# Altium schematic sheet MD_Power.SchDoc
size A3; SheetNumber: 2; SheetTotal: 2
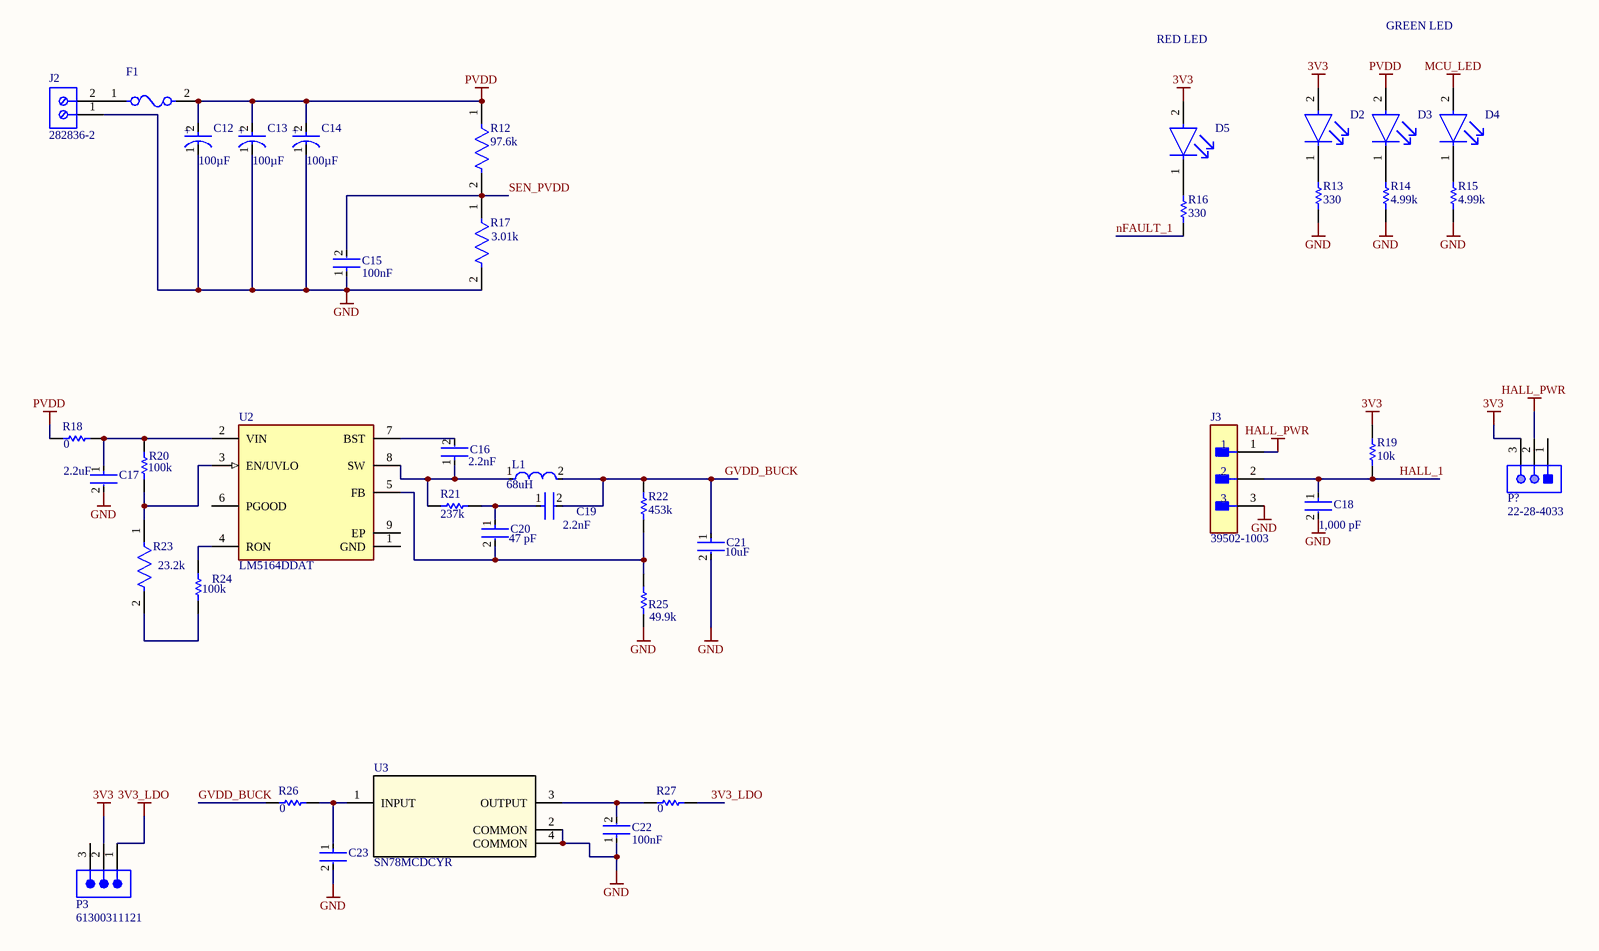
[diagram p0: MD_Power.SchDoc]

## Parts
C12  Capacitance: 100µF  [FP-TG-J16-MFG]  (hidden comment: EEV-TG2A101M)
C13  Capacitance: 100µF  [FP-TG-J16-MFG]  (hidden comment: EEV-TG2A101M)
C14  Capacitance: 100µF  [FP-TG-J16-MFG]  (hidden comment: EEV-TG2A101M)
C15  Capacitance: 100nF  [FP-1206-L_3_2_0_2-W_1_6_0-MFG]  (hidden comment: 12061C104KAZ2A)
C16  Capacitance: 2.2nF  [FP-1206-L_3_2_0_2-W_1_6_0-IPC_B]  (hidden comment: 12061A222JAT2A)
C17  Capacitance: 2.2uF  [FP-C3216-160-0_2-IPC_B]  (hidden comment: C3216X7S2A225K160AB)
C18  Capacitance: 1,000 pF  [FP-C1206C-EB-MFG]  (hidden comment: C1206C102J1GACTU)
C19  Capacitance: 2.2nF  [FP-1206-L_3_2_0_2-W_1_6_0-IPC_B]  (hidden comment: 12061A222JAT2A)
C20  Capacitance: 47 pF  [FP-C1206C-EB-MFG]  (hidden comment: C1206C470J1GACTU)
C21  Capacitance: 10uF  [FP-GRM31C-0_2-e0_3_0_8-MFG]  (hidden comment: GRM31CR71E106KA12L)
C22  Capacitance: 100nF  [FP-1206-L_3_2_0_2-W_1_6_0-MFG]  (hidden comment: 12061C104KAZ2A)
C23  C1206C334K5RACTU  [FP-C1206C-EB-MFG]  (value not drawn)
D2  LTST-C171GKT  [FP-LTST-C171GKT-MFG]  (value not drawn)
D3  LTST-C171GKT  [FP-LTST-C171GKT-MFG]  (value not drawn)
D4  LTST-C171GKT  [FP-LTST-C171GKT-MFG]  (value not drawn)
D5  HSMS-C150  [FP-HSMS-C150-MFG]  (value not drawn)
F1  0456030.ER  [FP-0456-MFG]  (value not drawn)
J2  282836-2  [TECO-282836-2_V]
J3  39502-1003  [FP-39502-1003-MFG]
L1  Inductance: 68uH  [FP-CDRH125-MFG]  (hidden comment: CDRH125NP-680MC)
P3  61300311121  [61300311121]
P?  22-28-4033  [MOLX-22-28-4033_V]
R12  Resistance: 97.6k  [FP-CR1206-MFG]  (hidden comment: CR1206-FX-9762ELF)
R13  Resistance: 330  [RESC3216X70X50NL05T20]  (hidden comment: ERJ-8GEYJ331V)
R14  Resistance: 4.99k  [RESC3216X60X45ML10T20]  (hidden comment: CRCW12064K99FKEA)
R15  Resistance: 4.99k  [RESC3216X60X45ML10T20]  (hidden comment: CRCW12064K99FKEA)
R16  Resistance: 330  [RESC3216X70X50NL05T20]  (hidden comment: ERJ-8GEYJ331V)
R17  Resistance: 3.01k  [FP-CRCW1206-e3-MFG]  (hidden comment: CRCW12063K01FKEA)
R18  Resistance: 0  [RESC3216X70X50NL05T20]  (hidden comment: ERJ-8GEY0R00V_DNP)
R19  Resistance: 10k  [RESC3116X65X50NL20T20]  (hidden comment: CRCW120610K0FKEAHP)
R20  Resistance: 100k  [RESC3216X70X50LL05T20]  (hidden comment: ERJ-8GEYJ104V)
R21  Resistance: 237k  [RESC3216X70X50LL05T20]  (hidden comment: ERJ-8ENF2373V)
R22  Resistance: 453k  [RESC3216X70X50NL05T20]  (hidden comment: ERJ-8ENF4533V)
R23  Resistance: 23.2k  [FP-CR1206-MFG]  (hidden comment: CR1206-FX-2322ELF)
R24  Resistance: 100k  [RESC3216X70X50LL05T20]  (hidden comment: ERJ-8GEYJ104V)
R25  Resistance: 49.9k  [RESC3216X65X50ML15T25]  (hidden comment: TNPW120649K9BEEA)
R26  Resistance: 0  [RESC3216X70X50NL05T20]  (hidden comment: ERJ-8GEY0R00V_DNP)
R27  Resistance: 0  [RESC3216X70X50NL05T20]  (hidden comment: ERJ-8GEY0R00V)
U2  LM5164DDAT  [FP-DDA0008E-MFG]
U3  SN78MCDCYR  [DCY0004A_N]

## Nets
3V3: D2.2(A) D5.2(A) P3.2 P?.3 R19.2
3V3_LDO: P3.1 R27.2
GND: C12.1(C) C13.1(C) C14.1(C) C15.1 C17.2 C18.2 C21.2 C22.1 C23.2 J2.1 J3.3 R13.1 R14.1 R15.1 R17.2 R25.1 U3.2(COMMON) U3.4(COMMON)
HALL_PWR: J3.1 P?.2
MCU_LED: D4.2(A)
PVDD: C12.2(A) C13.2(A) C14.2(A) D3.2(A) F1.2 R12.1 R18.1
GVDD_BUCK: C19.2 C21.1 L1.2 R22.2 R26.1
HALL_1: C18.1 J3.2 R19.1
nFAULT_1: R16.1
SEN_PVDD: C15.2 R12.2 R17.1
NetC16_1: C16.1 L1.1 R21.1 U2.8(SW)
NetC16_2: C16.2 U2.7(BST)
NetC17_1: C17.1 R18.2 R20.2 U2.2(VIN)
NetC19_1: C19.1 C20.1 R21.2
NetC20_2: C20.2 R22.1 R25.2 U2.5(FB)
NetC22_2: C22.2 R27.1 U3.3(OUTPUT)
NetC23_1: C23.1 R26.2 U3.1(INPUT)
NetD2_1: D2.1(C) R13.2
NetD3_1: D3.1(C) R14.2
NetD4_1: D4.1(C) R15.2
NetD5_1: D5.1(C) R16.2
NetF1_1: F1.1 J2.2
NetR20_1: R20.1 R23.1 U2.3(EN/UVLO)
NetR23_2: R23.2 R24.1
NetR24_2: R24.2 U2.4(RON)

Not connected (* = marked no-connect by the designer): P3 3; P? 1; U2 1(GND) 6(PGOOD) 9(EP)

## Notes on the sheet
- RED LED
- GREEN LED
- (in symbol CMP-00287-39480900-1) +

## Library data of the parts
C12-C14 = CMP-00287-39480900-1: Aluminum Electrolytic Capacitor, 100 uF, 100 V, ± 20%, 2000 hours @ 125°C, Radial Can - SMD; Ripple Current (AC): 350mA; Voltage Rating: 100V; Dissipation Factor: 10%; ESR (Equivalent Series Resistance): 300mΩ; Polarity: Polar; Leakage Current: 100µA; Lifecycle Status: Production; Height: 16.5mm; Lead Free: Lead Free; Case/Package: Radial; Termination: SMD/SMT; Tolerance: 20%; REACH SVHC: No SVHC; Schedule B: 8532220020, 8532220020; Ripple Current: 350mA; Mount: PCB, Surface Mount; Length: 16.5mm; Life (Hours): 2000hours; Radiation Hardening: No; Width: 1.2mm; Min Operating Temperature: -40°C; RoHS: Compliant; Voltage Rating (DC): 100V; Packaging: Cut Tape; Max Operating Temperature: 125°C; Diameter: 16mm; Height - Seated (Max): 16.51mm
C15 C22 = CMP-04427-004798-1: General Purpose Ceramic Capacitor, 1206, 100nF, 10%, X7R, 15%, 100V; Features: Soft Termination; Termination: SMD/SMT; Mount: Surface Mount; Tolerance: 10%; Voltage Rating: 100V; Length: 3.2mm; Case/Package: 1206; Case Code (Metric): 3216; RoHS Compliant: Yes; Package Quantity: 1; Max Operating Temperature: 125°C; Voltage Rating (DC): 100V; Min Operating Temperature: -55°C; Number of Pins: 2; Packaging: Tape and Reel; Width: 0.063inch; REACH SVHC: No SVHC; Lead Free: Lead Free; Construction: Flat; Radiation Hardening: No; Case Code (Imperial): 1206; Thickness: 0.05inch; Series: FLEXITERM®; Depth: 1.6mm; Dielectric: X7R
C16 C19 = CMP-04427-004655-1: General Purpose Ceramic Capacitor, 1206, 2.2nF, 5%, NP0, 30ppm/°C, 100V; Dielectric: C0G; Width: 0.063inch; Packaging: Tape and Reel; Depth: 1.6mm; Lead Free: Lead Free; Min Operating Temperature: -55°C; Radiation Hardening: No; Max Operating Temperature: 125°C; Thickness: 0.06inch; Temperature Coefficient: 30ppm/°C; Termination: SMD/SMT; Contact Plating: Tin; Voltage Rating: 100V; Number of Pins: 2; Case Code (Metric): 3216; Voltage Rating (DC): 100V; REACH SVHC: No SVHC; Voltage: 100V; RoHS Compliant: Yes; Package Quantity: 1; Height: 0.5mm; Case/Package: 1206; Length: 3.2mm; Mount: Surface Mount; Tolerance: 5%; Case Code (Imperial): 1206
C17 = CMP-08246-004303-1: Multilayer Ceramic Capacitors 2.2uF ±10% 100V X7S SMD 1206; Min Operating Temperature: -55°C; Tolerance: 10%; Number of Pins: 2; Case Code (Metric): 3216; REACH SVHC: No SVHC; Package Quantity: 1; Lead Free: Lead Free; Termination: SMD/SMT; Voltage Rating (DC): 100V; Voltage Rating: 100V; Case Code (Imperial): 1206; Dielectric: X7S; Height: 1.6mm; Packaging: Tape and Reel; Weight: 0.000571oz; Radiation Hardening: No; Mount: Surface Mount; Width: 0.063inch; Length: 3.2mm; Case/Package: 1206; Depth: 1.6mm; RoHS Compliant: Yes; Max Operating Temperature: 125°C; Series: C; Voltage: 100V; Resistor Type: Ceramic; Thickness: 0.071inch; Construction: Flat
C18 = CMP-03020-000955-1: Multilayer Ceramic Capacitor, C Series, 1000 Pf, - 5%, C0g / Np0, 100 V, 1206 [3216 Metric] Rohs Compliant: Yes; Manufacturer: KEMET; Voltage Rating: 100 V; Tolerance: 0.05; Automotive Grade: Grade 0; Temperature Coefficient: 15%; Value: 1,000 pF; Material: Ceramic; Ipc Land Pattern Name: CAPC320160X78; Octopart: https://octopart.com/c1206c102j1gactu-kemet-99808; Height: 0.88mm; Device Class L3: Ceramic Capacitors; Manufacturer Part Number: C1206C102J1GACTU; Digikey Description: Multilayer Ceramic Capacitor, C Series, 1000 Pf, - 5%, C0g / Np0, 100 V, 1206 [3216 Metric] Rohs Compliant: Yes; Package: C1206C-EB; Temperature: -55°C to +150°C; Category: Cap; Temperature Range High: +150°C; ComponentLink2Description: Datasheet; RoHS: TRUE; Temperature Range Low: -55°C; Device Class L1: Passive Components; Device Class L2: Capacitors; Lead Free: Yes; Automotive: Yes; ComponentLink2URL: https://content.kemet.com/datasheets/KEM_C1007_X8R_ULTRA_150C_SMD.pdf; Mouser Description: Multilayer Ceramic Capacitors MLCC - SMD/SMT 100volts 1000pF C0G 5%; Temperature Characteristic: C0G
C20 = CMP-1037-01300-2: CAP CER 47PF 100V 5% NP0 1206; Manufacturer: KEMET; Tolerance: 0.05; Material: Ceramic; Temperature Coefficient: 15%; Temperature Characteristic: C0G; Automotive Grade: Grade 0; Digikey Description: CAP CER 47PF 100V 5% NP0 1206; Temperature: -55°C to +150°C; Temperature Range Low: -55°C; Height: 0.88mm; RoHS: TRUE; Value: 47 pF; ComponentLink2URL: https://content.kemet.com/datasheets/KEM_C1007_X8R_ULTRA_150C_SMD.pdf; Octopart: https://octopart.com/c1206c470j1gactu-kemet-3801704; Temperature Range High: +150°C; Category: Cap; Mouser Description: 1206 47pF Ceramic Multilayer Capacitor; 100VDC; 125degC; C0G Dielec; +/-5% SMD; Package: C1206C-EB; Manufacturer Part Number: C1206C470J1GACTU; Ipc Land Pattern Name: CAPC320160X78; ComponentLink2Description: Datasheet; Device Class L1: Passive Components; Device Class L2: Capacitors; Voltage Rating: 100 V; Lead Free: Yes; Automotive: Yes; Device Class L3: Ceramic Capacitors
C21 = CMP-06035-003589-1: Chip Multilayer Ceramic Capacitors for General Purpose, 1206, 10uF, X7R, 15%, 10%, 25V; Case Code (Imperial): 1206; Voltage Rating (DC): 25V; Voltage Rating: 25V; Length: 3.2mm; Lead Free: Lead Free; Thickness: 0.071inch; Package Quantity: 1; Width: 1.6mm; Max Operating Temperature: 125°C; Number of Pins: 2; Height: 1.6mm; Case Code (Metric): 3216; REACH SVHC: No SVHC; Radiation Hardening: No; Case/Package: 1206; Material: Ceramic; Tolerance: 10%; Voltage: 25V; Mount: Surface Mount; Packaging: Tape and Reel; Dielectric: X7R; Termination: SMD/SMT; Min Operating Temperature: -55°C; Depth: 1.6mm
C23 = CMP-1037-04487-2: CAP CER 0.33UF 50V X7R 1206; Manufacturer: KEMET; Tolerance: 0.1; Automotive Grade: Grade 0; Value: 0.33 μF; Material: Ceramic; Temperature Coefficient: 15%; Ipc Land Pattern Name: CAPC320160X78; Octopart: https://octopart.com/c1206c334k5ractu-kemet-146059; Height: 0.88mm; Package: C1206C-EB; Manufacturer Part Number: C1206C334K5RACTU; ComponentLink2Description: Datasheet; Digikey Description: CAP CER 0.33UF 50V X7R 1206; Voltage Rating: 50 V; Temperature Range High: +150°C; Temperature: -55°C to +150°C; Automotive: Yes; Lead Free: Yes; Mouser Description: Multilayer Ceramic Capacitors MLCC - SMD/SMT 50volts 0.33uF X7R 10%; Category: Cap; RoHS: TRUE; Temperature Characteristic: X7R; Capacitance: 0.33 μF; Device Class L1: Passive Components; Temperature Range Low: -55°C; Device Class L2: Capacitors; Device Class L3: Ceramic Capacitors; ComponentLink2URL: https://content.kemet.com/datasheets/KEM_C1007_X8R_ULTRA_150C_SMD.pdf
D2-D4 = CMP-22017-000007-1: LED GREEN CLEAR CHIP SMD; Luminous Intensity: 12mcd; Lens Color: Colorless; Dominant Wavelength: 569nm; Number of LEDs: 1; Power Dissipation: 100mW; Viewing Angle: 130°; Reverse Voltage: 5V; Test Current: 10mA; Forward Voltage: 2.1V; Wavelength: 585nm; Lens Style: Diffused; Forward Current: 30mA; Height: 0.8mm; Mount: Surface Mount; Package Quantity: 1; Length: 2mm; Case Code (Metric): 2012; Number of Pins: 2; Number of Elements: 1; Packaging: Tape and Reel; Color: Green; Min Operating Temperature: -55°C; Case/Package: 0805; Power Rating: 100mW; Max Operating Temperature: 85°C; Radiation Hardening: No; Depth: 1.25mm; Lens Transparency: Clear; Width: 1.25mm; Lead Free: Lead Free; Case Code (Imperial): 0805; Illumination Color: Green
D5 = CMP-21615-000001-1: LED RED DIFFUSED CHIP SMD; Luminous Intensity: 10mcd; Power Dissipation: 65mW; Viewing Angle: 170°; Number of Elements: 1; Forward Current: 20mA; Lens Color: White; Lens Style: Rectangular; Wavelength: 626nm; Forward Voltage: 2.1V; Reverse Voltage: 5V; Number of Pins: 2; Color: Red; Lead Free: Lead Free; Width: 1.6mm; Length: 3.2mm; REACH SVHC: No SVHC; Height: 1.1mm; Depth: 1.6mm; Power Rating: 65mW; Package Quantity: 1; Illumination Color: Red; Radiation Hardening: No; Case Code (Imperial): 1206; Max Operating Temperature: 85°C; Test Current: 20mA; Case/Package: 1206; Lens Transparency: Diffused; Number of LEDs: 1; Packaging: Tape and Reel; Mount: Surface Mount; Min Operating Temperature: -40°C; Case Code (Metric): 3216; Dominant Wavelength: 626nm
F1 = CMP-2000-05709-2: FUSE BOARD MNT 30A 125VAC 72VDC; Manufacturer: Littelfuse; Fuse Interrupt Ac Current: 300A; Fuse Blow Speed: Fast; Voltage Rating: 125V; Max Fuse Dc Voltage: 72V; Fuse Interrupt Dc Current: 1000A; Resistance: 0.00132Ω; Value: 0.00132Ω; Fuse I2T: 81A2Sec; Fuse Voltage Drop: 69.9mV; Package: 0456; Digikey Description: FUSE BOARD MNT 30A 125VAC 72VDC; Mouser Description: 456 Series Fast-Acting 125 V 30 A 10.10 x 3.05 mm NANO2® SMT Ceramic Fuse; Height: 3.05mm; Temperature: -55°C to +125°C; Fuse Current: 30A; Octopart: https://octopart.com/0456030.er-littelfuse-7502597; Ipc Land Pattern Name: CAPC1008305X305; Device Class L3: unset; ComponentLink2URL: https://www.littelfuse.com/~/media/electronics/datasheets/fuses/littelfuse_fuse_456_datasheet.pdf.pdf; Automotive: No; Lead Free: Yes; Device Class L1: Circuit Protection; Temperature Range Low: -55°C; Category: Fuse; Max Fuse Ac Voltage: 125V; Temperature Range High: +125°C; RoHS: TRUE; ComponentLink2Description: Datasheet; Device Class L2: Fuses; Manufacturer Part Number: 0456030.ER
J2 = CMP-1684-00017-1: Female Header, Pitch 5 mm, 1 x 2 Position, Height 10 mm, Tail Length 3.5 mm, Rohs, Bulk; Manufacturer: TE Connectivity; Wire Gauge: 16-30AWG; Product Training Modules: Wire-to-BoardEurostyleTerminalBlocks; Clamp Material - Plating: Brass-NickelPlated; Voltage: 300V; Mating Orientation: HorizontalwithBoard; Current: 13.5A; Pitch: 0.197"(5.00mm); Screw Thread: M3; 3D Model: 282836-2.pdf; Other Names: 5ULV-02B / A98076; Dynamic Catalog: BuchananSeries; Number of Levels: 1; Torque - Screw: 0.68Nm(6Lb-In); Featured Product: EurostyleTerminalBlockConnectors; Positions Per Level: 2; Wire Termination: Screw-RisingCageClamp; Datasheet URL: http://www.te.com.cn/commerce/DocumentDelivery/DDEController?Action=showdoc&DocId=Catalog+Section%7F1308389_EUROSTYLE_TERMINAL_BLOCKS%7F0607%7Fpdf%7FEnglish%7FENG_CS_1308389_EUROSTYLE_TERMINAL_BLOCKS_0607.pdf%7F282836-2; Color: Green; Family: TerminalBlocks-WiretoBoard; RoHS Information: 282836-2StatementofCompliance; Standard Package: 300; Contact Material - Plating: Brass-TinPlated; Manufacturer URL: http://www.te.com; Housing Material: Polyamide(PA66),Nylon6/6; Features: Interlocking(Side); Package Description: Female Header, Pitch 5 mm, 1 x 2 Position, Height 10 mm, Tail Length 3.5 mm; Mounting Type: ThroughHole; Package Reference: THD; Packaging: Bulk; Series: Buchanan; Category: Connectors,Interconnects; Screw Material - Plating: Brass-NickelPlated
J3 = CMP-00257-00655380-1: 39502-1003 Terminal Block, pcb Mount, recept, 3 Contacts, pin Rohs Compliant: Yes; NexarPartId: 655380; Manufacturer Lifecycle Status: ACTIVE; Current: 8A; Voltage: 300V; Number of Positions Per Level: 3; Gender: Male; Contact Resistance: 8mΩ; Number of Levels: 1; Number of Circuits: 2; Pitch: 3.5mm; Length: 11.89mm; Mount: Through Hole; Number of Rows: 1; Country of Origin: US; Housing Color: Black; RoHS: Compliant; Lifecycle Status: Production; Schedule B: 8536694040; Housing Material: Polyamide; Orientation: Horizontal; Lead Free: Lead Free; Termination: Solder; Number of Contacts: 3; Depth: 9.2mm; Min Operating Temperature: -40°C; Color: Black; Max Operating Temperature: 105°C; Contact Plating: Tin; Current Rating: 8A; Contact Material: Brass; Number of Positions: 3
L1 = CMP-48855-000003-1: FIXED IND 68UH 1.5A 120 MOHM SMD; DC Resistance (DCR): 120mR; Tolerance: 20%; Shielding: Shielded; Test Frequency: 1kHz; Core Material: Ferrite; RoHS Compliant: Yes; Height - Seated (Max): 0.236inch; Packaging: Tape and Reel; Lead Free: Lead Free; Length: 12.3mm; Mount: Surface Mount; Current Rating: 1.5A; Width: 0.472inch; Radiation Hardening: No; Max Operating Temperature: 100°C; Depth: 12.3mm; Termination: SMD/SMT; Package Quantity: 1; Rated Current-Max: 1.5A; Height: 6mm; Max DC Current: 1.5A; DC Current: 1.5A; Military Standard: Not; Series: CDRH125; Case/Package: Nonstandard; Min Operating Temperature: -40°C
P3 = CMP-1502-01062-3: 3-pin header; NexarPartId: 32855521; Current Rating: 3A; Voltage Rating: 250V; Number of Positions: 3; Pitch: 2.54mm; Contact Resistance: 20mΩ; Connector Type: Male Pin; Gender: Male; REACH SVHC: Unknown; Packaging: Bulk; Contact Material: Copper; Min Operating Temperature: -40°C; Number of Rows: 1; Orientation: Vertical; RoHS: Compliant; Contact Plating: Gold; Max Operating Temperature: 105°C; Mount: Through Hole; Height: 8.94mm; Operating Supply Voltage: 250V; Number of Pins: 3; Contact Mating Length: 5.9944mm; Number of Contacts: 3; Color: Black; Lead Free: Lead Free; Lead Pitch: 2.54mm; Termination: Solder
P? = CMP-1676-00001-5: Male Header, Pitch 2.54 mm, 1 x 3 Position, Height 8.38 mm, Tail Length 3.18 mm, RoHS, Bulk; Manufacturer: Molex; Rows: 1; Voltage Rating: 250 V; Current Rating: 4 A; Min Operating Temperature: 0 degC; Lead Pitch: 0.1 inch; Packaging: Bulk; Contact Finish: Gold; RoHSCompliant: true; Contact Material: Brass; PackageReference: 22-28-4033; REACH SVHC: Unknown; PackageDescription: Male Header, Pitch 2.54 mm, 1 x 3 Position, Height 8.38 mm, Tail Length 3.18 mm; ComponentLink2URL: http://www.molex.com/pdm_docs/sd/022284033_sd.pdf; Height: 8.38 mm; Mounting Technology: Through Hole; ComponentLink1Description: Manufacturer URL; Length: 7.62 mm; Mount: Through Hole; DatasheetVersion: Rev. G, 01/2012; Max Operating Temperature: 75 degC; ComponentLink2Description: Datasheet; Colour: Black; Pins: 3; Contact Plating: Gold; Package Quantity: 1; ComponentLink1URL: http://www.molex.com/
R12 = CMP-07231-004609-1: Thick Film Chip Resistors 1206 97.6kΩ 0.25W 1% 100ppm/°C; Power Rating: 250mW; Voltage Rating: 200V; Max Operating Temperature: 155°C; Depth: 1.6mm; Tolerance: 1%; Height: 0.03inch; Thickness: 610um; Width: 0.063inch; Package Quantity: 5000; Termination: SMD/SMT; Temperature Coefficient: 100ppm/°C; Case Code (Imperial): 1206; Composition: Thick Film; Case Code (Metric): 3216; Mount: Surface Mount; Military Standard: Not; Contact Plating: Tin; Length: 3.2mm; Min Operating Temperature: -55°C; Features: Moisture Resistant; Packaging: Tape and Reel; Case/Package: 1206; Number of Terminations: 2; Max Power Dissipation: 250mW; Radiation Hardening: No
R13 R16 = CMP-2003-00612-1: Manufacturer: Panasonic; Part Number: ERJ-8GEYJ331V
R14 R15 = CMP-2003-02241-1: Manufacturer: Vishay Dale; Part Number: CRCW12064K99FKEA
R17 = CMP-2003-02146-2: RES Thick Film, 3.01kΩ, 1%, 0.25W, 100ppm/°C, 1206; Voltage Rating (DC): 200V; Power Rating: 250mW; Lead Free: Lead Free; Termination: SMD/SMT; Temperature Coefficient: 100ppm/°C; Package Quantity: 10; Contact Plating: Tin; Weight: 0.000353oz; Packaging: Tape and Reel; Min Operating Temperature: -55°C; Composition: Thick Film; Case/Package: 1206; Width: 0.063inch; Case Code (Imperial): 1206; Military Standard: Not; Length: 3.2mm; Voltage Rating: 200V; Depth: 1.6mm; Number of Terminations: 2; Height: 0.55mm; Max Power Dissipation: 250mW; Max Operating Temperature: 155°C; Features: Automotive AEC-Q200; Tolerance: 1%; Case Code (Metric): 3216; Radiation Hardening: No
R18 R26 R27 = CMP-2003-00541-1: Manufacturer: Panasonic; Part Number: ERJ-8GEY0R00V
R19 = CMP-2003-04883-1: Manufacturer: Vishay Dale; Part Number: CRCW120610K0FKEAHP
R20 R24 = CMP-2003-00546-1: Manufacturer: Panasonic; Part Number: ERJ-8GEYJ104V
R21 = CMP-2003-00236-1: Manufacturer: Panasonic; Part Number: ERJ-8ENF2373V
R22 = CMP-2003-00381-1: Manufacturer: Panasonic; Part Number: ERJ-8ENF4533V
R23 = CMP-07231-001388-1: Thick Film Chip Resistors 1206 23.2kΩ 0.25W 1% 100ppm/°C; Voltage Rating: 200V; Power Rating: 250mW; Width: 0.063inch; Features: Moisture Resistant; Packaging: Tape and Reel; Radiation Hardening: No; Max Power Dissipation: 250mW; Case Code (Imperial): 1206; Tolerance: 1%; Thickness: 610um; Height: 0.03inch; Length: 3.2mm; Min Operating Temperature: -55°C; Temperature Coefficient: 100ppm/°C; Max Operating Temperature: 155°C; Depth: 1.6mm; Contact Plating: Tin; Termination: SMD/SMT; Composition: Thick Film; Military Standard: Not; Case/Package: 1206; Mount: Surface Mount; Case Code (Metric): 3216; Number of Terminations: 2; Package Quantity: 5000
R25 = CMP-2003-04671-1: Manufacturer: Vishay Dale; Part Number: TNPW120649K9BEEA
U2 = CMP-04918-000052-1: IC REG BUCK ADJUSTABLE 1A 8SOPWR; Manufacturer: Texas Instruments; Nominal Supply Current: 600uA; Switching Frequency: 1000kHz; Number Of Outputs: 1; Min Supply Voltage: 6V; Max Junction Temp: +150°C; Max Duty Cycle: 100%; Output Voltage: 1.2-90V; Output Type: AdjustableProgrammable; Max Supply Voltage: 100V; Standoff Height: 0mm; Device Class L1: Integrated Circuits (ICs); Temperature Range High: +150°C; Lead Free: Yes; Temperature: -40°C to +150°C; Category: IC; Device Class L2: Power Management ICs; Digikey Description: IC REG BUCK ADJUSTABLE 1A 8SOPWR; Mouser Description: 6-V to 100-V input, 1-A synchronous buck DC-DC converter with ultra-low IQ 8-SO PowerPAD -40 to 150; Temperature Range Low: -40°C; Octopart: https://octopart.com/lm5164ddat-texas+instruments-96785745; ComponentLink2Description: Datasheet; Manufacturer Part Number: LM5164DDAT; Device Class L3: Voltage Regulators - Switching; Package: DDA0008E; RoHS: TRUE; Ipc Land Pattern Name: SOIC127P600X170-8; Output Current: 1A; Automotive: No; ComponentLink2URL: http://www.ti.com/lit/ds/symlink/lm5164.pdf; Height: 1.7mm; Switching Topology: Buck
U3 = SN78MCDCYR: No Description Available; Mfr_Name: Texas Instruments; TYPE: TYPE; RefDes: RefDes